# Altium schematic sheet Audio.SchDoc
size A4
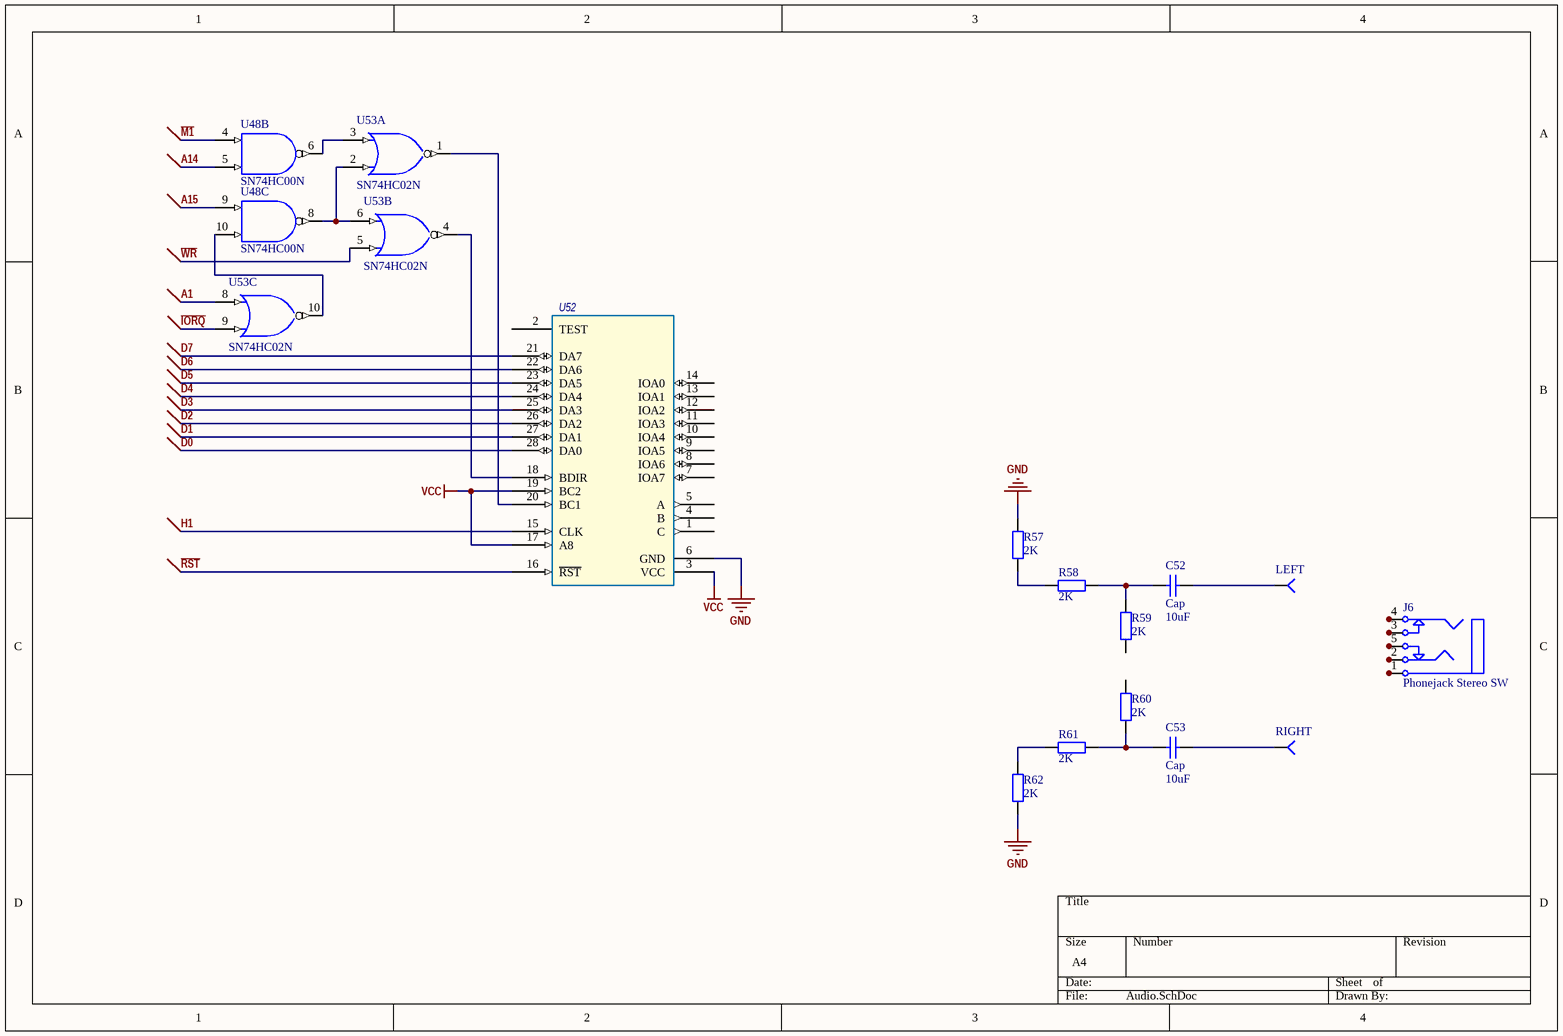
[diagram p0: Audio.SchDoc]

## Parts
C52  Cap  value 10uF  [RAD-0.3]
C53  Cap  value 10uF  [RAD-0.3]
J6  Phonejack Stereo SW  [ST-3150-5N]
LEFT  (no value)  [PIN1]
R57  value 2K  [AXIAL-0.4]  (hidden comment: Res2)
R58  value 2K  [AXIAL-0.4]  (hidden comment: Res2)
R59  value 2K  [AXIAL-0.4]  (hidden comment: Res2)
R60  value 2K  [AXIAL-0.4]  (hidden comment: Res2)
R61  value 2K  [AXIAL-0.4]  (hidden comment: Res2)
R62  value 2K  [AXIAL-0.4]  (hidden comment: Res2)
RIGHT  (no value)  [PIN1]
U48  SN74HC00N  [N014]  (parts B,C of 4)
U52  AY-3-8912  [FDIP28W]  (value not drawn)
U53  SN74HC02N  [N014]  (parts A,B,C of 4)

## Nets
GND: R57.2 R62.1 U48.7(GND) U52.6(GND) U53.7(GND)
VCC: U48.14(VCC) U52.3(VCC) U52.17(A8) U52.19(BC2) U53.14(VCC)
A1: U53.8(A)
A14: U48.5(B)
A15: U48.9(A)
D0: U52.28(DA0)
D1: U52.27(DA1)
D2: U52.26(DA2)
D3: U52.25(DA3)
D4: U52.24(DA4)
D5: U52.23(DA5)
D6: U52.22(DA6)
D7: U52.21(DA7)
H1: U52.15(CLK)
~{IORQ}: U53.9(B)
~{M1}: U48.4(A)
~{RST}: U52.16(~{RST})
~{WR}: U53.5(A)
NetC52_1: C52.1 R58.2 R59.2
NetC52_2: C52.2 LEFT.1
NetC53_1: C53.1 R60.1 R61.2
NetC53_2: C53.2 RIGHT.1
NetJ6_1: J6.1 J6.1A J6.1B
NetJ6_2: J6.2 J6.2A J6.2B
NetJ6_3: J6.3 J6.3A J6.3B
NetJ6_4: J6.4 J6.4A J6.4B
NetJ6_5: J6.5 J6.5A J6.5B
NetR57_1: R57.1 R58.1
NetR61_1: R61.1 R62.2
NetU48_6: U48.6(Y) U53.3(B)
NetU48_8: U48.8(Y) U53.2(A) U53.6(B)
NetU48_10: U48.10(B) U53.10(Y)
NetU52_18: U52.18(BDIR) U53.4(Y)
NetU52_20: U52.20(BC1) U53.1(Y)

Not connected (* = marked no-connect by the designer): R59 1; R60 2; U52 1(C) 2(TEST) 4(B) 5(A) 7(IOA7) 8(IOA6) 9(IOA5) 10(IOA4) 11(IOA3) 12(IOA2) 13(IOA1) 14(IOA0)

## Library data of the parts
C52 C53 = Cap: Capacitor; Published: 8-Jun-2000; LatestRevisionDate: 17-Jul-2002; LatestRevisionNote: Re-released for DXP Platform.; PackageReference: RAD-0.3; Publisher: Altium Limited; PackageDescription: Radial Cap, Thru-Hole; 2 Leads; 0.3 in Pin Spacing
J6 = Phonejack Stereo SW: 3-Conductor Jack with 2 break contacts (normals) and 2 auxiliary make contacts; Published: 5-Jan-2004; LatestRevisionDate: 17-Dec-2003; LatestRevisionNote: PCB Footprint replaced.; DatasheetDocument: 07-Mar-2000; Publisher: Altium Limited; ComponentLink1Description: Manufacturer Link; ComponentLink1URL: http://domino.kycon.com/internet/Products.html
LEFT RIGHT = Socket: LatestRevisionDate: 17-Jul-2002; LatestRevisionNote: Re-released for DXP Platform.; Publisher: Altium Limited
R57-R62 = Res2: Resistor; Published: 8-Jun-2000; LatestRevisionDate: 17-Jul-2002; LatestRevisionNote: Re-released for DXP Platform.; PackageReference: AXIAL-0.4; Publisher: Altium Limited; PackageDescription: Axial Device, Thru-Hole; 2 Leads; 0.4 in Pin Spacing
U48 = SN74HC00N: Quadruple 2-Input Positive-NAND Gate; Published: 8-Jun-2000; LatestRevisionDate: 04-Mar-2005; LatestRevisionNote: Stylized 3D Model Added.; DatasheetVersion: May-1997; PackageVersion: Oct-1995; PackageReference: N014; Publisher: Altium Limited; PackageDescription: DIP; 14 Leads; Row Spacing 7.62 mm; Pitch 2.54 mm; ComponentLink1Description: Manufacturer Link; ComponentLink1URL: http://www.ti.com/; ComponentLink2Description: Datasheet; ComponentLink2URL: http://www-s.ti.com/sc/ds/sn74hc00.pdf
U53 = SN74HC02N: Quadruple 2-Input Positive-NOR Gate; Published: 8-Jun-2000; LatestRevisionDate: 04-Mar-2005; LatestRevisionNote: Stylized 3D Model Added.; DatasheetVersion: May-1997; PackageVersion: Oct-1995; PackageReference: N014; Publisher: Altium Limited; PackageDescription: DIP; 14 Leads; Row Spacing 7.62 mm; Pitch 2.54 mm; ComponentLink1Description: Manufacturer Link; ComponentLink1URL: http://www.ti.com/; ComponentLink2Description: Datasheet; ComponentLink2URL: http://www-s.ti.com/sc/ds/sn74hc02.pdf